# EAGLE schematic untitled (EAGLE 7.2.0)
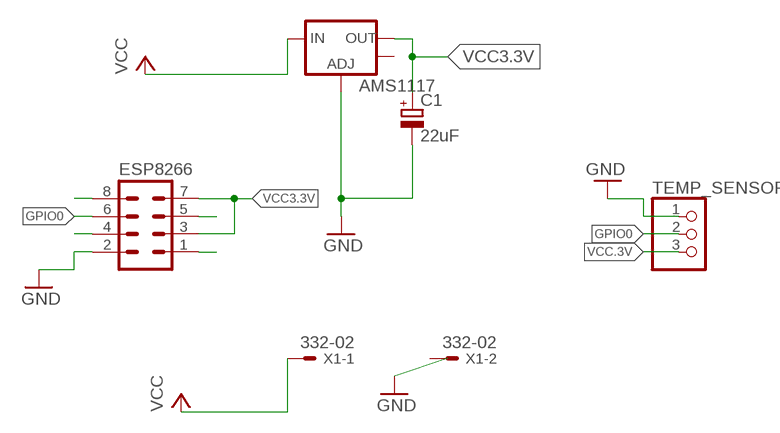
[diagram p0: schematic, sheet 1]

## Parts
AMS1117  V_REG_LM1117SOT223  [SOT223]
C1  22uF  CPOL-EUE1.8-4  [E1,8-4]
ESP8266  MA04-2  [MA04-2]
TEMP_SENSOR  PINHD-1X3  [1X03]
X1  332-02  [332-02]

## Nets
GND: AMS1117.1(ADJ) C1.- ESP8266.2 TEMP_SENSOR.1
GPIO0: ESP8266.6 TEMP_SENSOR.2
N$1: ESP8266.5
N$4: ESP8266.1
N$6: ESP8266.4
N$8: ESP8266.8
VCC: AMS1117.3(IN) X1.1
VCC3.3V: AMS1117.2(OUT) C1.+ ESP8266.3 ESP8266.7
VCC.3V: TEMP_SENSOR.3
Unconnected: AMS1117.4(OUT) X1.2

## Library data of the parts
AMS1117 = SparkFun-PowerIC:V_REG_LM1117: Voltage Regulator LM1117 Standard adjustable voltage regulator but in SMD form. Spark Fun Electronics SKU : COM-00595; PROD_ID: VREG-08170
C1 = resistor:CPOL-EU: POLARIZED CAPACITOR, European symbol
ESP8266 = con-lstb:MA04-2: PIN HEADER; OC_FARNELL: unknown; OC_NEWARK: unknown
TEMP_SENSOR = pinhead:PINHD-1X3: PIN HEADER
X1 = con-garry:332-02: 2 Pin - 2mm Dual Row Source: www.mpe-connector.de / garry_shortform_2012.pdf